# EAGLE design 5V-DCDC (EAGLE 9.6.2)
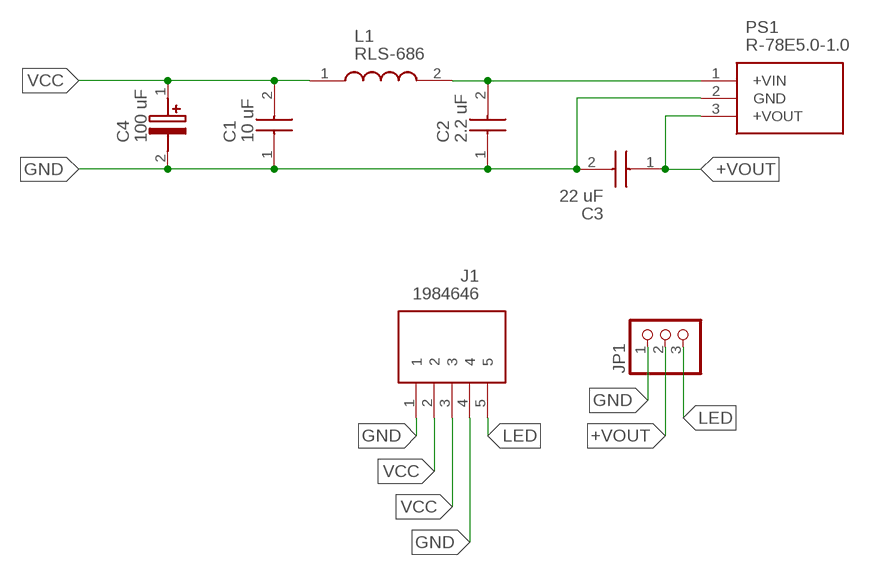
[diagram p0: schematic, sheet 1]

## Parts
C1  10 uF  C1206C226M4PACTU  [CAPC3216X180N]
C2  2.2 uF  C1206C226M4PACTU  [CAPC3216X180N]
C3  22 uF  C1206C226M4PACTU  [CAPC3216X180N]
C4  100 uF  865080445010  [CAPAE660X770N]
J1  1984646  [1984646]
JP1  PINHD-1X3  [1X03]
L1  RLS-686  [RLS686]
PS1  R-78E5.0-1.0  [R78E5010]

## Nets
+VIN: C2.2 L1.2 PS1.1(+VIN)
+VOUT: C3.1 JP1.2 PS1.3(+VOUT)
GND: C1.1 C2.1 C3.2 C4.2(-) J1.1 J1.4 JP1.1 PS1.2(GND)
LED: J1.5 JP1.3
VCC: C1.2 C4.1(+) J1.2 J1.3 L1.1

## Library data of the parts
C1-C3 = SamacSys_Parts:C1206C226M4PACTU: KEMET 1206 (3216M) 22uF MLCC 16V dc +/-20% SMD C1206C226M4PACTU Source: Datasheet <https://api.kemet.com/component-edge/download/specsheet/C1206C226M4PACTU.pdf>; DESCRIPTION: KEMET 1206 (3216M) 22uF MLCC 16V dc +/-20% SMD C1206C226M4PACTU; HEIGHT: 1.8mm; MANUFACTURER_NAME: Kemet; MANUFACTURER_PART_NUMBER: C1206C226M4PACTU; MOUSER_PART_NUMBER: 80-C1206C226M4P; MOUSER_PRICE-STOCK: https://www.mouser.co.uk/ProductDetail/KEMET/C1206C226M4PACTU?qs=vBH1GPjCw2UZFSd%252B4IU1Qg%3D%3D
C4 = SamacSys_Parts:865080445010: Wurth Elektronik Aluminium Electrolytic Capacitor 100uF 25V dc 6.3mm V-Chip WCAP-ASLI Series Aluminium, Surface Mount Source: Datasheet <https://katalog.we-online.com/pbs/datasheet/865080445010.pdf>; DESCRIPTION: Wurth Elektronik Aluminium Electrolytic Capacitor 100uF 25V dc 6.3mm V-Chip WCAP-ASLI Series Aluminium, Surface Mount; HEIGHT: 7.7mm; MANUFACTURER_NAME: Wurth Elektronik; MANUFACTURER_PART_NUMBER: 865080445010; MOUSER_PART_NUMBER: 710-865080445010; MOUSER_PRICE-STOCK: https://www.mouser.co.uk/ProductDetail/Wurth-Elektronik/865080445010?qs=0KOYDY2FL29KjsP7WHszFQ%3D%3D
J1 = SamacSys_Parts:1984646: Phoenix Contact, COMBICON PT 3.5mm Pitch, 5 Way PCB Terminal Strip Source: Datasheet <https://www.phoenixcontact.com/online/portal/in?uri=pxc-oc-itemdetail:pid=1984646&library=inen&tab=1>; DESCRIPTION: Phoenix Contact, COMBICON PT 3.5mm Pitch, 5 Way PCB Terminal Strip; HEIGHT: 9.3mm; MANUFACTURER_NAME: Phoenix Contact; MANUFACTURER_PART_NUMBER: 1984646
JP1 = pinhead:PINHD-1X3: PIN HEADER
L1 = SamacSys_Parts:RLS-686: Fixed Inductors Line Inductors for RECOM Power Supply Source: Datasheet <https://componentsearchengine.com/Datasheets/1/RLS-686.pdf>; DESCRIPTION: Fixed Inductors Line Inductors for RECOM Power Supply; HEIGHT: 5.5mm; MANUFACTURER_NAME: RECOM Power; MANUFACTURER_PART_NUMBER: RLS-686; MOUSER_PART_NUMBER: 919-RLS-686; MOUSER_PRICE-STOCK: https://www.mouser.co.uk/ProductDetail/RECOM-Power/RLS-686?qs=gZXFycFWdAPkuw4EqL4CBw%3D%3D
PS1 = SamacSys_Parts:R-78E5.0-1.0: Non-Isolated DC/DC Converters 8-28Vin 5V 1.0A THRU Source: Datasheet <http://www.recom-power.com/pdf/Innoline/R-78Exx-1.0.pdf>; DESCRIPTION: Non-Isolated DC/DC Converters 8-28Vin 5V 1.0A THRU; HEIGHT: 10.4mm; MANUFACTURER_NAME: RECOM Power; MANUFACTURER_PART_NUMBER: R-78E5.0-1.0; MOUSER_PART_NUMBER: 919-R-78E5.0-1.0; MOUSER_PRICE-STOCK: https://www.mouser.co.uk/ProductDetail/RECOM-Power/R-78E50-10?qs=T0XSgvH75d4EsZCU9I5HVA%3D%3D

## Board
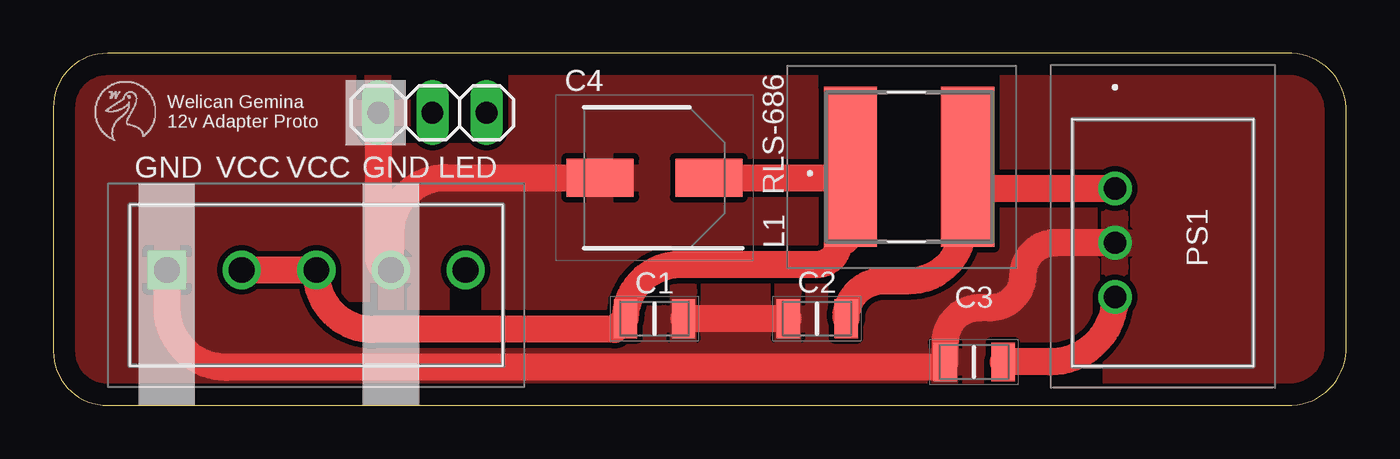
[diagram p1: board, top side]
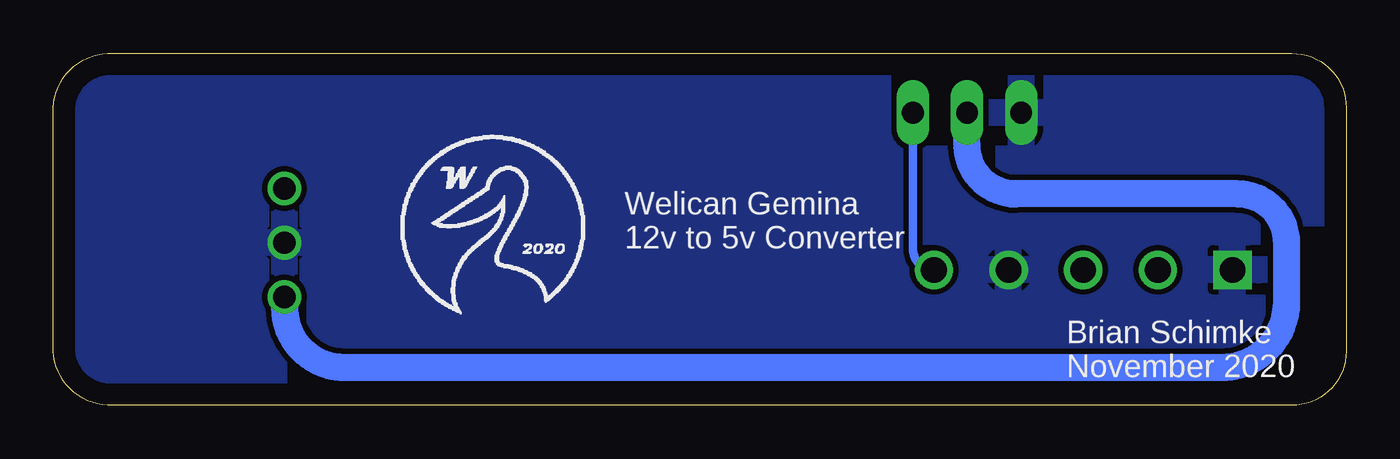
[diagram p2: board, bottom side, seen from below]

Size 60.63 x 16.5 mm. Coordinates in mm from the lower left corner, seen from the top.
Outline: 0,13.96 0,2.54 arc90 2.54,0 57.84,0 arc90 60.63,2.54 60.63,13.96 arc90 57.84,16.5 2.54,16.5 arc90 0,13.96
Copper layers (1*16): Top 0.035mm / dielectric 1.5mm / Bottom 0.035mm
Design rules "default": minimum track width 6mil, minimum drill 0.35mm, track to track 6mil, track to pad 6mil, pad to pad 6mil, via to via 6mil, smd to smd 6mil, copper to edge 40mil, drill to drill 6mil, minimum pad ring 10mil, minimum via ring 8mil, stop-mask expansion 4mil, vias tented up to drill 0mil, thermal gap 10mil

### Footprints (pad centres in the part's own frame; a part is rotated, then mirrored left to right if it is on the bottom)
CAPC3216X180N = smd 1.1 x 1.82: 1 -1.36,0; 2 1.36,0
CAPAE660X770N = smd 3.15 x 1.8: 1 -2.55,0; 2 2.55,0
1984646 = drill 1.2 pad 1.8 square: 1 0,0 | drill 1.2 pad 1.8: 2 3.5,0; 3 7,0; 4 10.5,0; 5 14,0
1X03 = drill 1.016 long: 1 -2.54,0; 2 0,0; 3 2.54,0
RLS686 = smd 2.5 x 7.5: 1 -2.75,0; 2 2.75,0
R78E5010 = drill 1.05 pad 1.575: 1 0,0; 2 2.54,0; 3 5.08,0

### Placement (x,y rotation side)
C1  28.19,4.06 180 top
C2  35.81,4.06 0 top
C3  43.18,2.03 180 top
C4  28.19,10.67 180 top
J1  5.33,6.35 0 top
JP1  17.78,13.72 0 top
L1  40.13,11.18 0 top
PS1  49.78,10.16 270 top

### Tracks (layer width: path | path; a pad name or v marks a point on that pad's centre or on a via)
+VIN
  Top 1.27: PS1.1 42.67,10.16 | 42.67,10.16 42.67,10.97 arc-90 L1.2 | C2.2 arc-90 38.95,5.84 40.13,5.84 arc90 42.67,8.38 42.67,10.16
+VOUT
  Top 1.27: PS1.3 arc-90 46.74,2.03 C3.1
  Bottom 1.27: PS1.3 49.78,4.57 arc-90 46.99,1.78 5.84,1.78 arc-90 2.79,4.83 2.79,7.62 arc-90 5.08,9.91 15.49,9.91 arc90 17.78,12.19 JP1.2
GND
  Top 1.27: C2.1 C1.1 | J1.1 5.33,4.57 arc90 8.13,1.78 41.57,1.78 C3.2 41.82,2.96 arc-90 43.43,4.57 43.94,4.57 arc90 45.47,6.1 arc-90 46.99,7.62 PS1.2 | C4.2 18.37,10.67 arc90 15.83,8.13 J1.4 arc-90 15.24,6.94 JP1.1
  pour Top (isolate 0.254): 0.51,16.26 57.66,16.26 arc-90 60.2,13.72 60.2,3.05 arc-90 57.66,0.51 1.52,0.51 arc-90 -0.51,2.54 -0.51,15.24 arc-90
  pour Bottom (isolate 0.254): 0.76,16 57.4,16 arc-90 59.94,13.46 59.94,3.05 arc-90 57.4,0.51 2.54,0.51 arc-90 0,3.05 0,15.24 arc-90
LED
  Bottom 0.406: JP1.3 20.32,7.34 arc-90 J1.5
VCC
  Top 1.27: J1.2 J1.3 12.33,6.21 arc90 14.99,3.56 26.33,3.56 C1.2 arc-90 29.37,6.6 35.81,6.6 arc90 36.83,7.62 arc90 37.38,8.17 L1.1 arc-90 36.87,10.67 C4.1

### Text on the board
tNames: Welican Gemina / 12v Adapter Proto | GND | VCC | VCC | GND | LED | RLS-686
bNames: Welican Gemina / 12v to 5v Converter | Brian Schimke / November 2020